# Altium schematic sheet 05_kbd_pm.SchDoc
size B
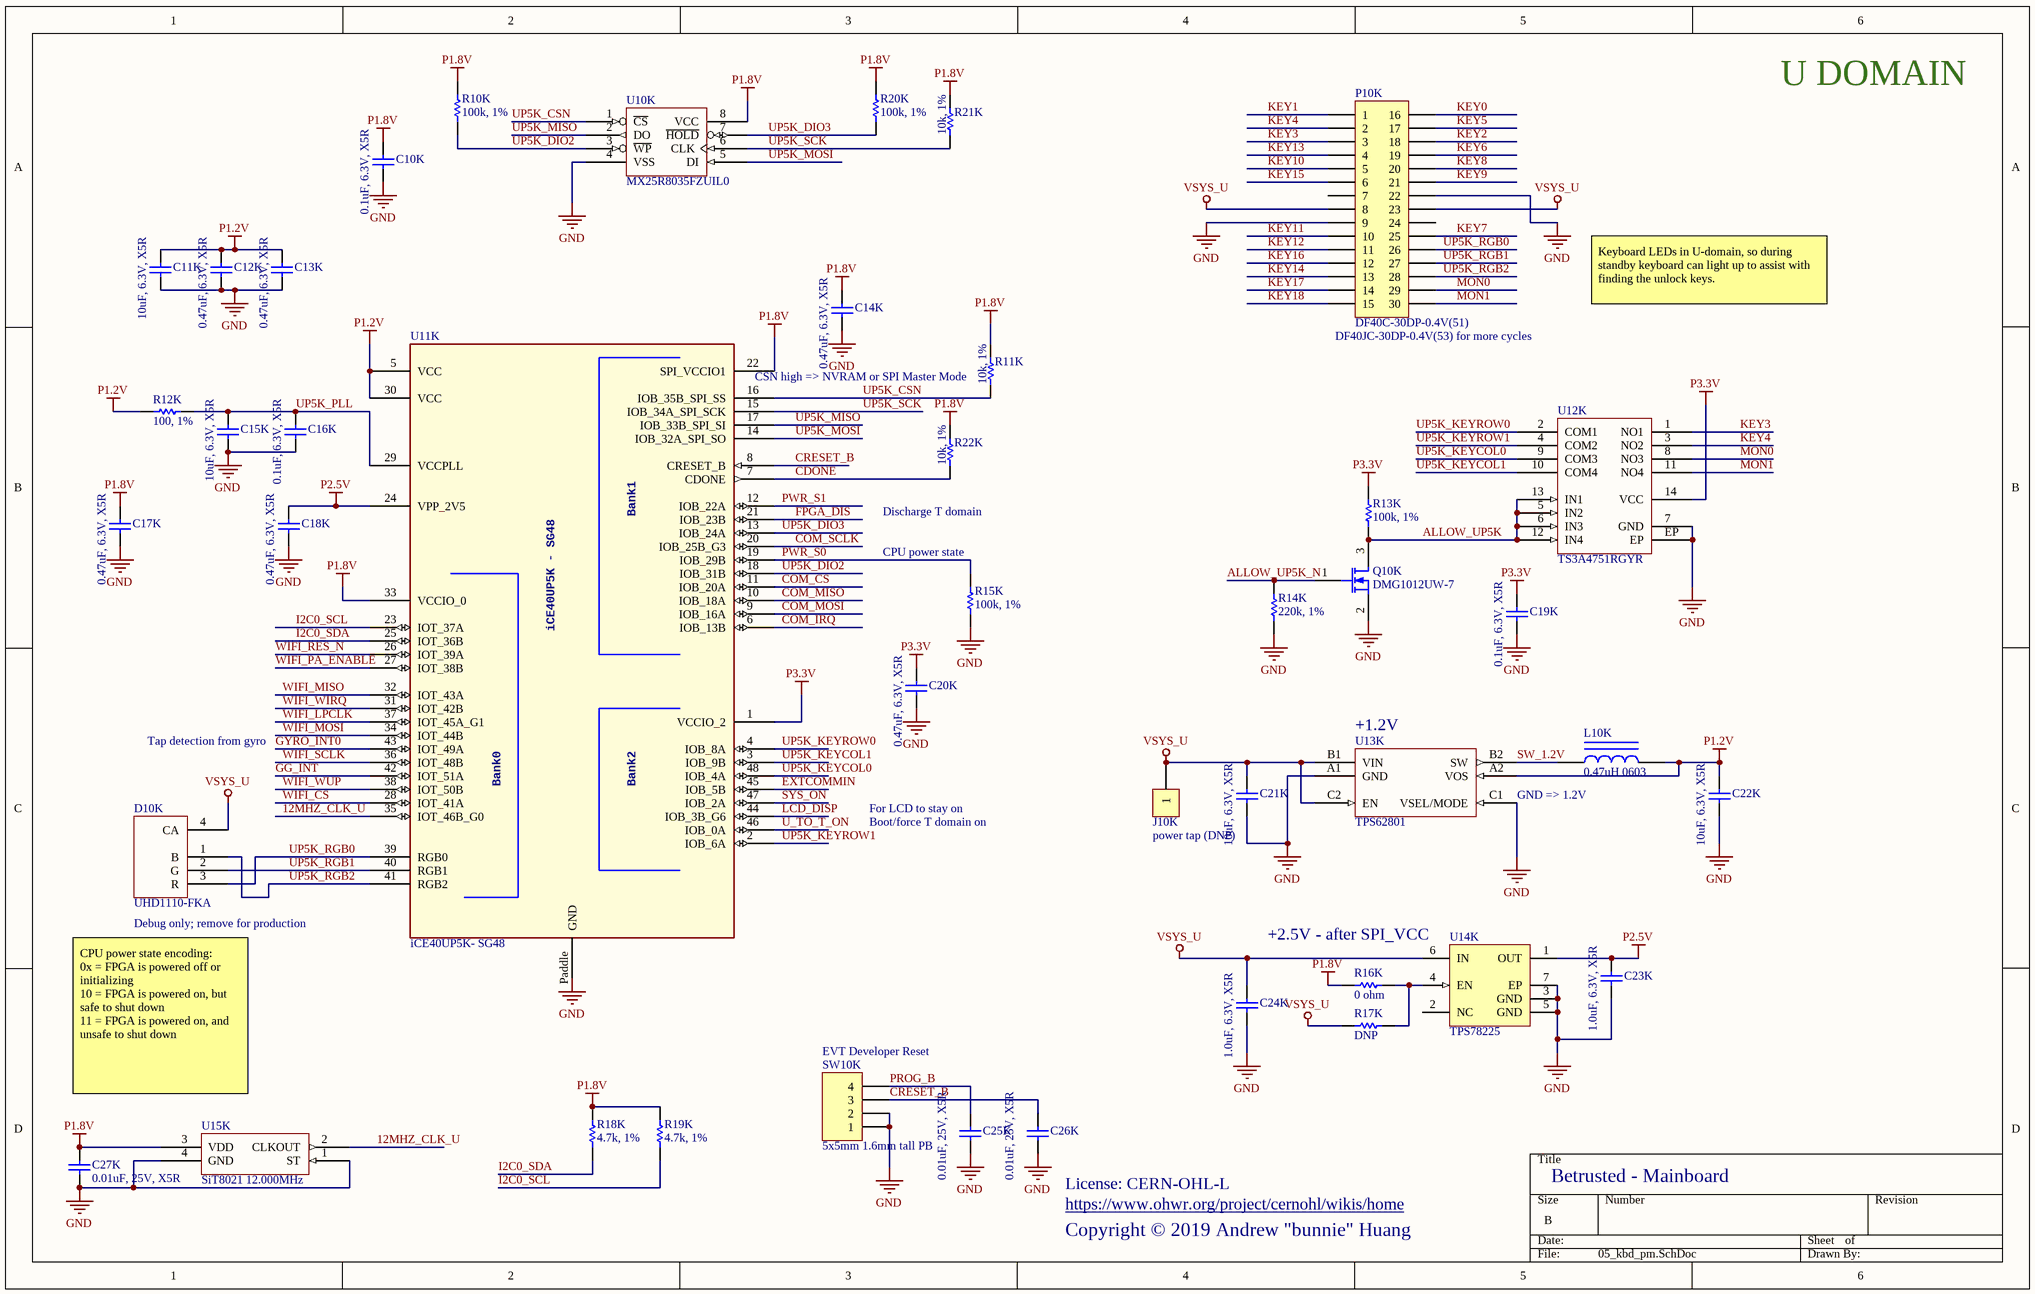
[diagram p0: 05_kbd_pm.SchDoc]

## Parts
C10K  0.1uF, 6.3V, X5R  [B_CAP0201]
C11K  10uF, 6.3V, X5R  [B_CAP0603]
C12K  0.47uF, 6.3V, X5R  [B_CAP0201]
C13K  0.47uF, 6.3V, X5R  [B_CAP0201]
C14K  0.47uF, 6.3V, X5R  [B_CAP0201]
C15K  10uF, 6.3V, X5R  [B_CAP0603]
C16K  0.1uF, 6.3V, X5R  [B_CAP0201]
C17K  0.47uF, 6.3V, X5R  [B_CAP0201]
C18K  0.47uF, 6.3V, X5R  [B_CAP0201]
C19K  0.1uF, 6.3V, X5R  [B_CAP0201]
C20K  0.47uF, 6.3V, X5R  [B_CAP0201]
C21K  10uF, 6.3V, X5R  [B_CAP0603]
C22K  10uF, 6.3V, X5R  [B_CAP0603]
C23K  1.0uF, 6.3V, X5R  [B_CAP0201]
C24K  1.0uF, 6.3V, X5R  [B_CAP0201]
C25K  0.01uF, 25V, X5R  [B_RES0201]
C26K  0.01uF, 25V, X5R  [B_RES0201]
C27K  0.01uF, 25V, X5R  [B_RES0201]
D10K  UHD1110-FKA  [CREE_UHD1110-FKA]
J10K  power tap (DNP)  [RESTAP-0603]
L10K  0.47uH 0603  [B_IND0603]
P10K  DF40C-30DP-0.4V(51)  [HRS_DF40C-30DP-0.4V(51)]
Q10K  DMG1012UW-7  [SOT323-3AN]
R10K  100k, 1%  [B_RES0201]
R11K  10k, 1%  [B_RES0201]
R12K  100, 1%  [B_RES0402]
R13K  100k, 1%  [B_RES0201]
R14K  220k, 1%  [B_RES0201]
R15K  100k, 1%  [B_RES0201]
R16K  0 ohm  [B_RES0201]
R17K  DNP  [B_RES0201]
R18K  4.7k, 1%  [B_RES0201]
R19K  4.7k, 1%  [B_RES0201]
R20K  100k, 1%  [B_RES0201]
R21K  10k, 1%  [B_RES0201]
R22K  10k, 1%  [B_RES0201]
SW10K  5x5mm 1.6mm tall PB  [SWITCH_TS-1187A]
U10K  MX25R8035FZUIL0  [USON-8]
U11K  iCE40UP5K- SG48  [UP5K_QFN127P600-8N]
U12K  TS3A4751RGYR  [TI_RGY_S_PVQFN-N14]
U13K  TPS62801  [BGA6C35P2X3_70X105X40_NSMD]
U14K  TPS78225  [TI-DRV6-1600X1000TP_V]
U15K  SiT8021 12.000MHz  [SiTIME_CSP]

## Nets
GND: C10K.2 C11K.2 C12K.2 C13K.2 C14K.2 C15K.2 C16K.2 C17K.2 C18K.2 C19K.2 C20K.2 C21K.2 C22K.2 C23K.2 C24K.2 C25K.2 C26K.2 C27K.2 P10K.9 P10K.22 Q10K.2(S) R14K.1 R15K.1 SW10K.1 SW10K.2 U10K.4(VSS) U11K.Paddle(GND) U12K.7(GND) U12K.EP U13K.A1(GND) U13K.C1(VSEL/MODE) U14K.3(GND) U14K.5(GND) U14K.7(EP) U15K.1(ST) U15K.4(GND)
P1.2V: C11K.1 C12K.1 C13K.1 C22K.1 L10K.2 R12K.2 U11K.5(VCC) U11K.30(VCC) U13K.A2(VOS)
P1.8V: C10K.1 C14K.1 C17K.1 C27K.1 R10K.2 R11K.1 R16K.1 R18K.2 R19K.2 R20K.2 R21K.1 R22K.1 U10K.8(VCC) U11K.22(SPI_VCCIO1) U11K.33(VCCIO_0) U15K.3(VDD)
P2.5V: C18K.1 C23K.1 U11K.24(VPP_2V5) U14K.1(OUT)
P3.3V: C19K.1 C20K.1 R13K.2 U11K.1(VCCIO_2) U12K.14(VCC)
VSYS_U: C21K.1 C24K.1 D10K.4(CA) J10K.1 P10K.8 P10K.23 R17K.1 U13K.B1(VIN) U13K.C2(EN) U14K.6(IN)
12MHZ_CLK_U: U11K.35(IOT_46B_G0) U15K.2(CLKOUT)
ALLOW_UP5K: Q10K.3(D) R13K.1 U12K.5(IN2) U12K.6(IN3) U12K.12(IN4) U12K.13(IN1)
ALLOW_UP5K_N: Q10K.1(G) R14K.2
CDONE: R22K.2 U11K.7(CDONE)
COM_CS: U11K.11(IOB_20A)
COM_IRQ: U11K.6(IOB_13B)
COM_MISO: U11K.10(IOB_18A)
COM_MOSI: U11K.9(IOB_16A)
COM_SCLK: U11K.20(IOB_25B_G3)
CRESET_B: C26K.1 SW10K.3 U11K.8(CRESET_B)
EXTCOMMIN: U11K.45(IOB_5B)
FPGA_DIS: U11K.21(IOB_23B)
GG_INT: U11K.42(IOT_51A)
GYRO_INT0: U11K.43(IOT_49A)
I2C0_SCL: R19K.1 U11K.23(IOT_37A)
I2C0_SDA: R18K.1 U11K.25(IOT_36B)
KEY0: P10K.16
KEY1: P10K.1
KEY2: P10K.18
KEY3: P10K.3 U12K.1(NO1)
KEY4: P10K.2 U12K.3(NO2)
KEY5: P10K.17
KEY6: P10K.19
KEY7: P10K.25
KEY8: P10K.20
KEY9: P10K.21
KEY10: P10K.5
KEY11: P10K.10
KEY12: P10K.11
KEY13: P10K.4
KEY14: P10K.13
KEY15: P10K.6
KEY16: P10K.12
KEY17: P10K.14
KEY18: P10K.15
LCD_DISP: U11K.44(IOB_3B_G6)
MON0: P10K.29 U12K.8(NO3)
MON1: P10K.30 U12K.11(NO4)
PROG_B: C25K.1 SW10K.4
PWR_S0: R15K.2 U11K.19(IOB_29B)
PWR_S1: U11K.12(IOB_22A)
SW_1.2V: L10K.1 U13K.B2(SW)
SYS_ON: U11K.47(IOB_2A)
U_TO_T_ON: U11K.46(IOB_0A)
UP5K_CSN: R11K.2 U10K.1(~{CS}) U11K.16(IOB_35B_SPI_SS)
UP5K_DIO2: R10K.1 U10K.3(~{WP}) U11K.18(IOB_31B)
UP5K_DIO3: R20K.1 U10K.7(~{HOLD}) U11K.13(IOB_24A)
UP5K_KEYCOL0: U11K.48(IOB_4A) U12K.9(COM3)
UP5K_KEYCOL1: U11K.3(IOB_9B) U12K.10(COM4)
UP5K_KEYROW0: U11K.4(IOB_8A) U12K.2(COM1)
UP5K_KEYROW1: U11K.2(IOB_6A) U12K.4(COM2)
UP5K_MISO: U10K.2(DO) U11K.17(IOB_33B_SPI_SI)
UP5K_MOSI: U10K.5(DI) U11K.14(IOB_32A_SPI_SO)
UP5K_PLL: C15K.1 C16K.1 R12K.1 U11K.29(VCCPLL)
UP5K_RGB0: D10K.3(R) P10K.26 U11K.39(RGB0)
UP5K_RGB1: D10K.2(G) P10K.27 U11K.40(RGB1)
UP5K_RGB2: D10K.1(B) P10K.28 U11K.41(RGB2)
UP5K_SCK: R21K.2 U10K.6(CLK) U11K.15(IOB_34A_SPI_SCK)
WIFI_CS: U11K.28(IOT_41A)
WIFI_LPCLK: U11K.37(IOT_45A_G1)
WIFI_MISO: U11K.32(IOT_43A)
WIFI_MOSI: U11K.34(IOT_44B)
WIFI_PA_ENABLE: U11K.27(IOT_38B)
WIFI_RES_N: U11K.26(IOT_39A)
WIFI_SCLK: U11K.36(IOT_48B)
WIFI_WIRQ: U11K.31(IOT_42B)
WIFI_WUP: U11K.38(IOT_50B)
NetR16K_2: R16K.2 R17K.2 U14K.4(EN)

Not connected (* = marked no-connect by the designer): P10K 7 24; U14K 2(NC)

## Notes on the sheet
- U DOMAIN
- Keyboard LEDs in U-domain, so during standby keyboard can light up to assist with finding the unlock keys.
- (near P10K) DF40JC-30DP-0.4V(53) for more cycles
- CSN high => NVRAM or SPI Master Mode
- (near R15K) CPU power state
- (near R22K) Discharge T domain
- Tap detection from gyro
- (near U13K) +1.2V
- Boot/force T domain on
- For LCD to stay on
- GND => 1.2V
- (near D10K) Debug only; remove for production
- (near U14K) +2.5V - after SPI_VCC
- CPU power state encoding:
  0x = FPGA is powered off or initializing
  10 = FPGA is powered on, but safe to shut down
  11 = FPGA is powered on, and unsafe to shut down
- (near SW10K) EVT Developer Reset
- Betrusted - Mainboard
- (near C26K) License: CERN-OHL-L
- Copyright © 2019 Andrew "bunnie" Huang
- https://www.ohwr.org/project/cernohl/wikis/home
- (in symbol iCE40UP5K- SG48) Bank1; iCE40UP5K - SG48; Bank0; Bank2

## Library data of the parts
C10K C16K C19K = Cap Semi: Capacitor (Semiconductor SIM Model); MPN: CL03A104KQ3NNNC; VENDOR: Samsung; MYPN: C-104-6p3-X5R-0201
C11K C15K C21K C22K = Cap Semi: Capacitor (Semiconductor SIM Model); MPN: CL10A106MQ8NNNC; VENDOR: Samsung; MYPN: C-106-6.3-X5R-0603
C12K C13K C14K C17K C18K C20K = Cap Semi: Capacitor (Semiconductor SIM Model); MPN: CL03A474KQ3NNNH; VENDOR: Samsung; MYPN: C-474-6p3-X5R-0201
C23K C24K = Cap Semi: Capacitor (Semiconductor SIM Model); MPN: GRM033R60J105MEA2D; VENDOR: Murata; MYPN: C-105-6p3-X5R-0201
C25K C26K C27K = Cap Semi: Capacitor (Semiconductor SIM Model); MPN: GRM033R61E103KA12D; VENDOR: Murata; MYPN: C-103-25-X5R-0201
D10K = CREE_UHD1110-FKA: 1x1mm SMD RGB LED, 5mA, common anode; MPN: UHD1110-FKA-CL1A13R3Q1BBQFMF3; VENDOR: Cree; MYPN: UHD1110-FKA
J10K = CON1: Connector; MYPN: J-TP-PWRTAP-0603; MPN: DNP; VENDOR: DNP
L10K = Inductor Iron: Magnetic-Core Inductor; MPN: TFM160808ALC-R47MTAA; VENDOR: TDK; MYPN: L-TFM160808ALC-R47MTAA
P10K = Header 15X2A: Header, 15-Pin, Dual row; MYPN: J-DF40C-30DP-0.4V(51) or DF40JC-30DP-0.4V(53); VENDOR: Hirose; System: Connector; LatestRevisionDate: 17-Jul-2002; LatestRevisionNote: Re-released for DXP Platform.; Publisher: Altium Limited; MPN: DF40C-30DP-0.4V(51)
Q10K = MOSFET-N: N-Channel MOSFET; VENDOR: Diodes Inc; MYPN: Q-DMG1012UW-7; Published: 8-Jun-2000; LatestRevisionDate: 17-Jul-2002; LatestRevisionNote: Re-released for DXP Platform.; PackageVersion: 1995/1996; PackageReference: E3; Publisher: Altium Limited; MPN: DMG1012UW-7
R10K R13K R15K R20K = Res1: Resistor; VENDOR: ANY; MYPN: R-104-1P-1_16W-0201; MPN: ANY
R11K R21K R22K = Res1: Resistor; VENDOR: ANY; MYPN: R-103-1P-1_16W-0201; MPN: ANY
R12K = Res1: Resistor; VENDOR: ANY; MYPN: R-101-1P-1_16W-0402; MPN: ANY
R14K = Res1: Resistor; VENDOR: ANY; MYPN: R-224-1P-1_16W-0201; MPN: ANY
R16K = Res1: Resistor; VENDOR: ANY; MYPN: R-0R0-1P-1_16W-0201; MPN: ANY
R17K = Res1: Resistor; VENDOR: ANY; MYPN: DNP; MPN: ANY
R18K R19K = Res1: Resistor; VENDOR: ANY; MYPN: R-472-1P-1_16W-0201; MPN: ANY
SW10K = Header 4: Chi Fung TS-1187A; MPN: RS-187R05A2-DS MT RT; VENDOR: C&K; MYPN: SW-PB-5X5-1.6; LatestRevisionDate: 17-Jul-2002; LatestRevisionNote: Re-released for DXP Platform.; Publisher: Altium Limited
U10K = EN25P05-50GCP: 64Mbit SPI NOR FLASH; MYPN: UMX25R8035FZUIL0; VENDOR: Macronix; MPN: MX25R8035FZUIL0
U12K = TS3A4751RGYR: 0.9 ohm low voltage, single supply, 4-channel SPST analog switch; MYPN: U-TS3A4751RGYR; VENDOR: TI; MPN: TS3A4751RGYR
U13K = TPS62801: Buck regulator, 4MHz, 0.6A, 0.8V-1.55V, low Iq; MPN: TPS62801YKAT; VENDOR: TI; MYPN: U-TPS62801YKA(T/R)
U14K = TI-TPS78225-Q1DRV6-1600X1000TP: 500nA Iq, 150mA LDO; MPN: TPS78225DRVT; VENDOR: TI; MYPN: U-TPS78225DRV(T/R)
U15K = SiT8021: 1 to 26 MHz micropower oscillator; MPN: SIT8021AI-J4-18S-12.000000E; VENDOR: SiTime; MYPN: U-SIT8021AI-J4-18S-12.000000E